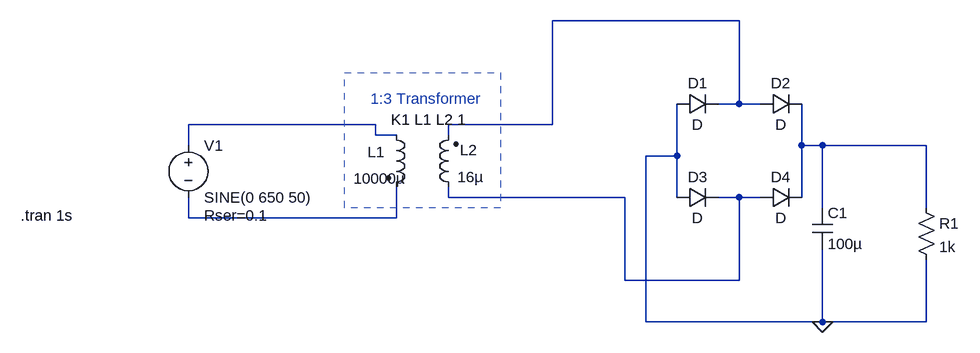
[diagram p0: schematic Draft1.asc]
Draft1.asc, the LTspice schematic file:
Version 4
SHEET 1 1464 680
WIRE 1120 -144 832 -144
WIRE 1120 -16 1120 -144
WIRE 1120 -16 1088 -16
WIRE 1152 -16 1120 -16
WIRE 560 16 272 16
WIRE 832 16 832 -144
WIRE 832 16 672 16
WIRE 560 32 560 16
WIRE 592 32 560 32
WIRE 672 32 672 16
WIRE 272 48 272 16
WIRE 1216 48 1216 -16
WIRE 1248 48 1216 48
WIRE 1408 48 1248 48
WIRE 1024 64 1024 -16
WIRE 1024 64 976 64
WIRE 672 128 672 112
WIRE 944 128 672 128
WIRE 1024 128 1024 64
WIRE 1120 128 1088 128
WIRE 1152 128 1120 128
WIRE 1216 128 1216 48
WIRE 1248 144 1248 48
WIRE 1408 144 1408 48
WIRE 272 160 272 128
WIRE 592 160 592 112
WIRE 592 160 272 160
WIRE 944 256 944 128
WIRE 1120 256 1120 128
WIRE 1120 256 944 256
WIRE 976 320 976 64
WIRE 1248 320 1248 208
WIRE 1248 320 976 320
WIRE 1408 320 1408 224
WIRE 1408 320 1248 320
FLAG 1248 320 0
SYMBOL voltage 272 32 R0
WINDOW 123 0 0 Left 2
WINDOW 39 24 124 Left 2
SYMATTR InstName V1
SYMATTR Value SINE(0 650 50)
SYMATTR SpiceLine Rser=0.1
SYMBOL ind2 576 16 R0
WINDOW 0 -28 42 Left 2
WINDOW 3 -50 83 Left 2
SYMATTR InstName L1
SYMATTR Value 10000µ
SYMATTR SpiceLine Rpar=0.1
SYMBOL ind2 688 128 R180
WINDOW 0 -29 73 Left 2
WINDOW 3 -39 31 Left 2
SYMATTR InstName L2
SYMATTR Value 16µ
SYMBOL diode 1024 0 R270
WINDOW 0 32 32 VTop 2
WINDOW 3 0 32 VBottom 2
SYMATTR InstName D1
SYMBOL diode 1152 0 R270
WINDOW 0 32 32 VTop 2
WINDOW 3 0 32 VBottom 2
SYMATTR InstName D2
SYMBOL diode 1024 144 R270
WINDOW 0 32 32 VTop 2
WINDOW 3 0 32 VBottom 2
SYMATTR InstName D3
SYMBOL diode 1152 144 R270
WINDOW 0 32 32 VTop 2
WINDOW 3 0 32 VBottom 2
SYMATTR InstName D4
SYMBOL cap 1232 144 R0
SYMATTR InstName C1
SYMATTR Value 100µ
SYMBOL res 1392 128 R0
SYMATTR InstName R1
SYMATTR Value 1k
TEXT 14 156 Left 2 !.tran 1s
TEXT 584 8 Left 2 !K1 L1 L2 1
TEXT 552 -24 Left 2 ;1:3 Transformer
RECTANGLE Normal 752 144 512 -64 2

The netlist it stands for:
* Draft1.asc
V1 N002 N005 SINE(0 650 50) Rser=0.1
L1 N002 N005 10000µ Rpar=0.1
L2 N004 N001 16µ
D1 0 N001 D
D2 N001 N003 D
D3 0 N004 D
D4 N004 N003 D
C1 N003 0 100µ
R1 N003 0 1k
.model D D
.lib standard.dio
.tran 1s
K1 L1 L2 1
* 1:3 Transformer
.backanno
.end